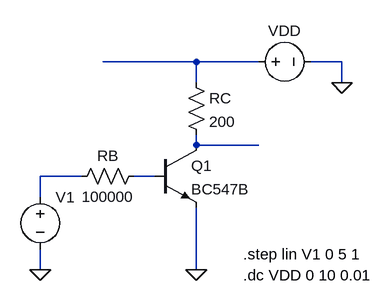
[diagram p0: schematic bipolarcharcteristics.asc]
bipolarcharcteristics.asc, the LTspice schematic file:
Version 4.1
SHEET 1 880 680
WIRE 256 -32 112 -32
WIRE 352 -32 256 -32
WIRE 480 -32 432 -32
WIRE 256 0 256 -32
WIRE 480 0 480 -32
WIRE 256 96 256 80
WIRE 352 96 256 96
WIRE 80 144 16 144
WIRE 192 144 160 144
WIRE 16 176 16 144
WIRE 16 288 16 256
WIRE 256 288 256 192
FLAG 16 288 0
FLAG 256 288 0
FLAG 480 0 0
SYMBOL voltage 16 160 R0
WINDOW 3 24 44 Left 2
WINDOW 123 0 0 Left 0
WINDOW 39 0 0 Left 0
SYMATTR InstName V1
SYMATTR Value ""
SYMBOL res 64 160 R270
WINDOW 0 32 56 VTop 2
WINDOW 3 0 56 VBottom 2
SYMATTR InstName RB
SYMATTR Value 100000
SYMBOL npn 192 96 R0
SYMATTR InstName Q1
SYMATTR Value BC547B
SYMBOL res 240 -16 R0
SYMATTR InstName RC
SYMATTR Value 200
SYMBOL voltage 336 -32 R270
WINDOW 0 32 56 VTop 2
WINDOW 3 -32 56 VBottom 2
WINDOW 123 0 0 Left 0
WINDOW 39 0 0 Left 0
SYMATTR InstName VDD
SYMATTR Value ""
TEXT 328 264 Left 2 !.step lin V1 0 5 1
TEXT 328 296 Left 2 !.dc VDD 0 10 0.01

The netlist it stands for:
* bipolarcharcteristics.asc
V1 N003 0
RB N003 N004 100000
Q1 N002 N004 0 0 BC547B
RC N001 N002 200
VDD N001 0
.model NPN NPN
.model PNP PNP
.lib standard.bjt
.step lin V1 0 5 1
.dc VDD 0 10 0.01
.backanno
.end